# EAGLE design pannel (EAGLE 4.16)
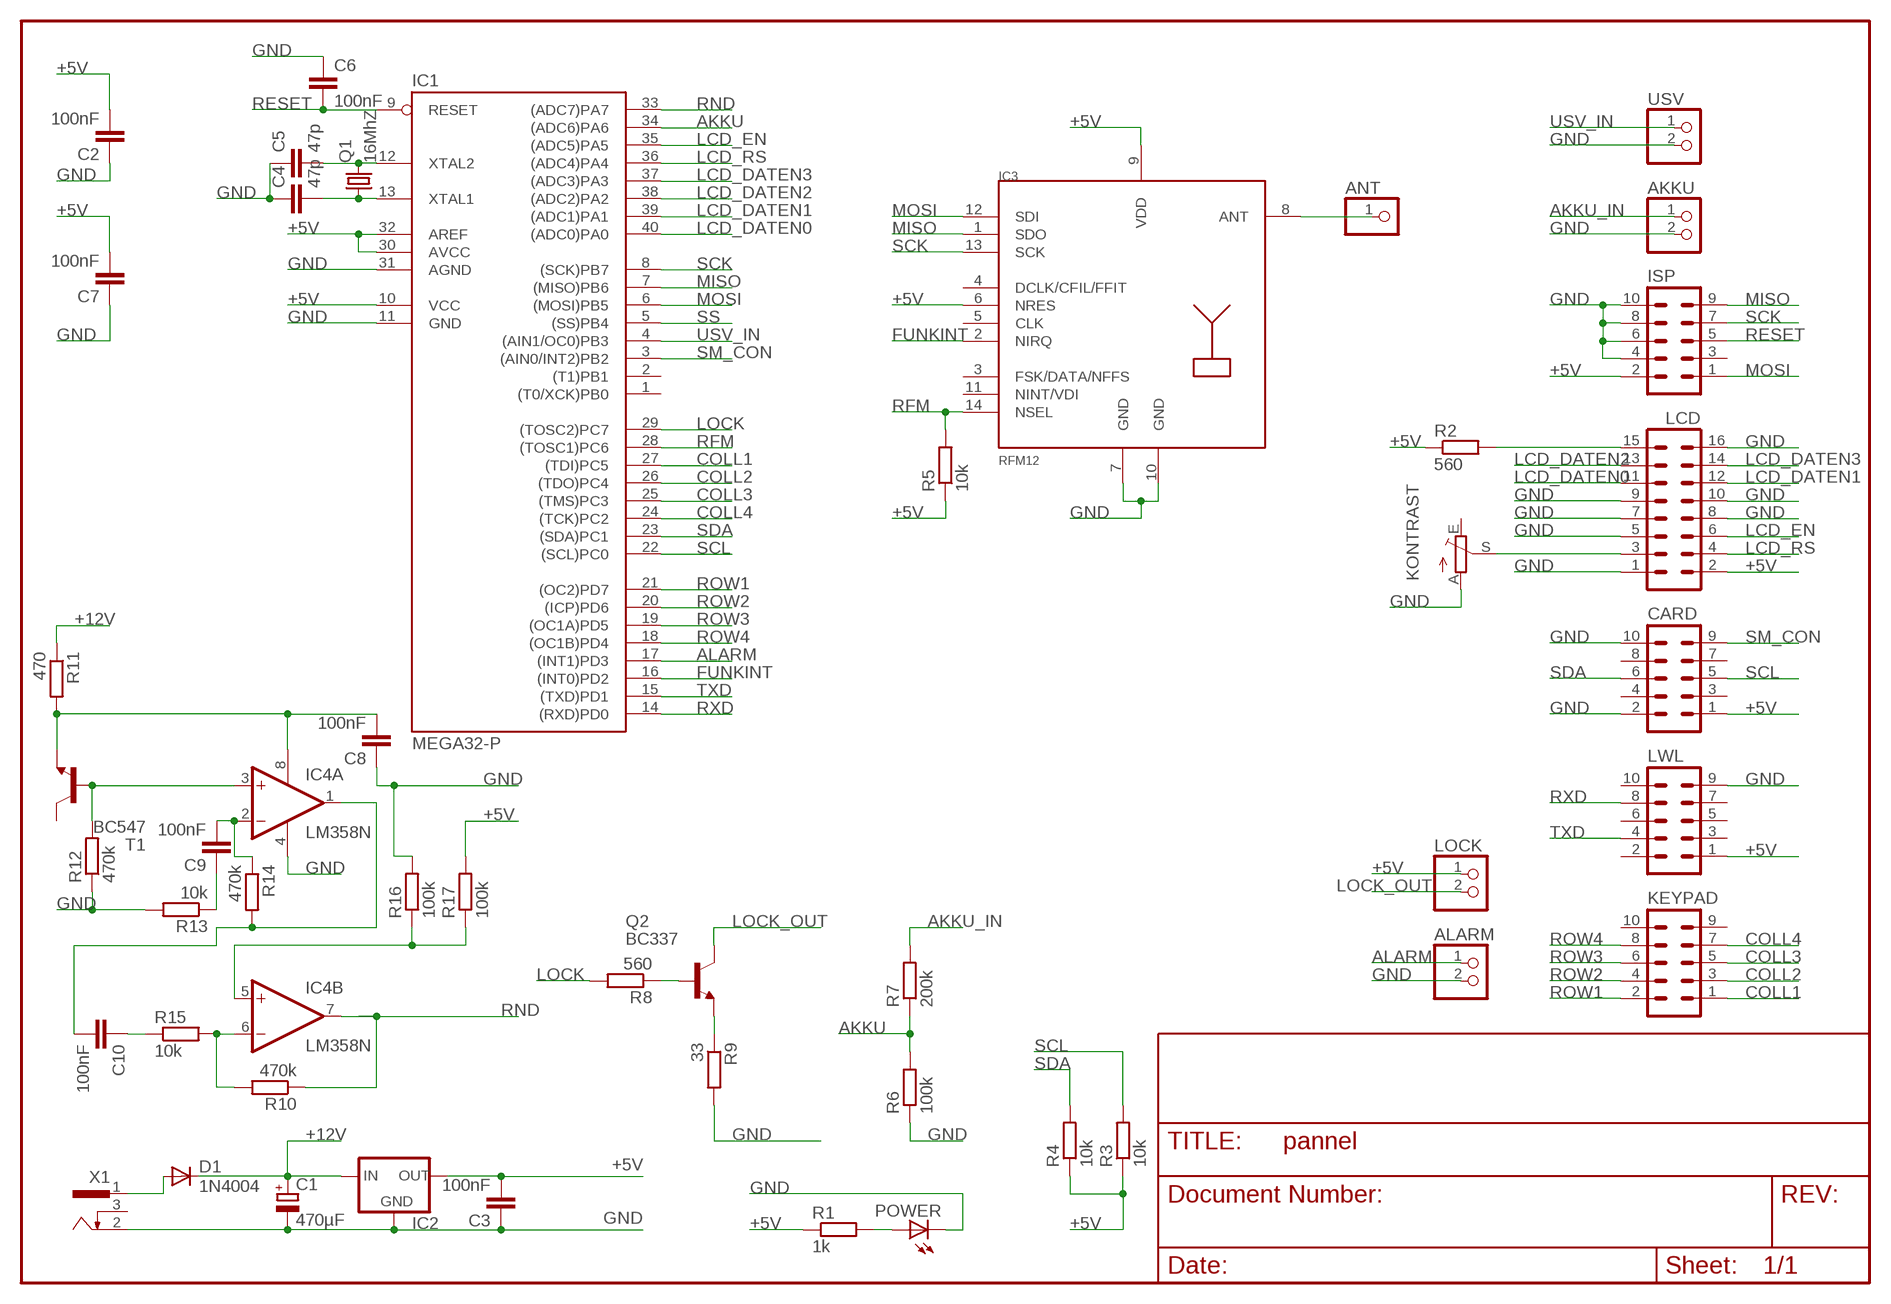
[diagram p0: schematic, sheet 1]

## Parts
AKKU  PINHD-1X2  [1X02]
ALARM  PINHD-1X2  [1X02]
ANT  PINHD-1X1  [1X01]
C1  470µF  CPOL-EUE5-8.5  [E5-8,5]
C2  100nF  C-EU025-030X050  [C025-030X050]
C3  100nF  C-EU025-030X050  [C025-030X050]
C4  47p  C-EU025-030X050  [C025-030X050]
C5  47p  C-EU025-030X050  [C025-030X050]
C6  100nF  C-EU025-030X050  [C025-030X050]
C7  100nF  C-EU025-030X050  [C025-030X050]
C8  100nF  C-EU025-030X050  [C025-030X050]
C9  100nF  C-EU025-030X050  [C025-030X050]
C10  100nF  C-EU025-030X050  [C025-030X050]
CARD  ML10  [ML10]
D1  1N4004  [DO41-10]
IC1  MEGA32-P  [DIL40]
IC2  78XXL  [78XXL]
IC3  RFM12  [RFM]
IC4  LM358N  [DIL08]
ISP  ML10  [ML10]
KEYPAD  ML10  [ML10]
KONTRAST  TRIM_EU-LI15  [LI15]
LCD  ML16  [ML16]
LOCK  PINHD-1X2  [1X02]
LWL  ML10  [ML10]
POWER  LED5MM  [LED5MM]
Q1  16MhZ  CRYSTALHC49S  [HC49/S]
Q2  BC337  [TO92]
R1  1k  R-EU_0207/12  [0207/12]
R2  560  R-EU_0207/12  [0207/12]
R3  10k  R-EU_0207/12  [0207/12]
R4  10k  R-EU_0207/12  [0207/12]
R5  10k  R-EU_0207/12  [0207/12]
R6  100k  R-EU_0207/12  [0207/12]
R7  200k  R-EU_0207/12  [0207/12]
R8  560  R-EU_0207/12  [0207/12]
R9  33  R-EU_0207/12  [0207/12]
R10  470k  R-EU_0207/12  [0207/12]
R11  470  R-EU_0207/12  [0207/12]
R12  470k  R-EU_0207/12  [0207/12]
R13  10k  R-EU_0207/12  [0207/12]
R14  470k  R-EU_0207/12  [0207/12]
R15  10k  R-EU_0207/12  [0207/12]
R16  100k  R-EU_0207/12  [0207/12]
R17  100k  R-EU_0207/12  [0207/12]
T1  BC547  [TO92]
USV  PINHD-1X2  [1X02]
X1  733980-62  [733980-62]

## Nets
+5V: C2.2 C3.2 C7.2 CARD.1 IC1.10(VCC) IC1.30(AVCC) IC1.32(AREF) IC2.OUT IC3.6(NRES) IC3.9(VDD) ISP.2 LCD.2 LOCK.1 LWL.1 R1.1 R2.1 R3.1 R4.1 R5.1 R17.2
+12V: C1.+ D1.C IC2.IN R11.1
AKKU: IC1.34((ADC6)PA6) R6.2 R7.1
AKKU_IN: AKKU.1 R7.2
ALARM: ALARM.1 IC1.17((INT1)PD3)
COLL1: IC1.27((TDI)PC5) KEYPAD.1
COLL2: IC1.26((TDO)PC4) KEYPAD.3
COLL3: IC1.25((TMS)PC3) KEYPAD.5
COLL4: IC1.24((TCK)PC2) KEYPAD.7
FUNKINT: IC1.16((INT0)PD2) IC3.2(NIRQ)
GND: AKKU.2 ALARM.2 C1.- C2.1 C3.1 C4.1 C5.1 C6.1 C7.1 C8.1 CARD.2 CARD.10 IC1.11(GND) IC1.31(AGND) IC2.GND IC3.7(GND) IC3.10(GND) IC4.4(P:V-) ISP.4 ISP.6 ISP.8 ISP.10 KONTRAST.A LCD.1 LCD.5 LCD.7 LCD.8 LCD.9 LCD.10 LCD.16 LWL.9 POWER.K(C) R6.1 R9.2 R12.1 R13.2 R16.2 USV.2 X1.2
LCD_DATEN0: IC1.40((ADC0)PA0) LCD.11
LCD_DATEN1: IC1.39((ADC1)PA1) LCD.12
LCD_DATEN2: IC1.38((ADC2)PA2) LCD.13
LCD_DATEN3: IC1.37((ADC3)PA3) LCD.14
LCD_EN: IC1.35((ADC5)PA5) LCD.6
LCD_RS: IC1.36((ADC4)PA4) LCD.4
LOCK: IC1.29((TOSC2)PC7) R8.2
LOCK_OUT: LOCK.2 Q2.3(C)
MISO: IC1.7((MISO)PB6) IC3.1(SDO) ISP.9
MOSI: IC1.6((MOSI)PB5) IC3.12(SDI) ISP.1
N$1: D1.A X1.1
N$2: C8.2 IC4.8(P:V+) R11.2 T1.1(E)
N$3: POWER.A R1.2
N$4: C4.2 IC1.13(XTAL1) Q1.1
N$5: C5.2 IC1.12(XTAL2) Q1.2
N$6: KONTRAST.S LCD.3
N$7: ANT.1 IC3.8(ANT)
N$8: Q2.2(B) R8.1
N$9: Q2.1(E) R9.1
N$10: IC4.6(B:-IN) R10.2 R15.2
N$11: IC4.3(A:+IN) R12.2 T1.2(B)
N$12: LCD.15 R2.2
N$13: C9.1 R13.1
N$14: C9.2 IC4.2(A:-IN) R14.1
N$15: IC4.5(B:+IN) R16.1 R17.1
N$16: C10.1 R15.1
N$18: C10.2 IC4.1(A:OUT) R14.2
RESET: C6.2 IC1.9(RESET) ISP.5
RFM: IC1.28((TOSC1)PC6) IC3.14(NSEL) R5.2
RND: IC1.33((ADC7)PA7) IC4.7(B:OUT) R10.1
ROW1: IC1.21((OC2)PD7) KEYPAD.2
ROW2: IC1.20((ICP)PD6) KEYPAD.4
ROW3: IC1.19((OC1A)PD5) KEYPAD.6
ROW4: IC1.18((OC1B)PD4) KEYPAD.8
RXD: IC1.14((RXD)PD0) LWL.8
SCK: IC1.8((SCK)PB7) IC3.13(SCK) ISP.7
SCL: CARD.5 IC1.22((SCL)PC0) R3.2
SDA: CARD.6 IC1.23((SDA)PC1) R4.2
SM_CON: CARD.9 IC1.3((AIN0/INT2)PB2)
SS: IC1.5((SS)PB4)
TXD: IC1.15((TXD)PD1) LWL.4
USV_IN: IC1.4((AIN1/OC0)PB3) USV.1
Unconnected: CARD.3 CARD.4 CARD.7 CARD.8 IC1.1((T0/XCK)PB0) IC1.2((T1)PB1) IC3.3(FSK/DATA/NFFS) IC3.4(DCLK/CFIL/FFIT) IC3.5(CLK) IC3.11(NINT/VDI) ISP.3 KEYPAD.9 KEYPAD.10 KONTRAST.E LWL.2 LWL.3 LWL.5 LWL.6 LWL.7 LWL.10 T1.3(C) X1.3

## Library data of the parts
AKKU ALARM LOCK USV = pinhead:PINHD-1X2: PIN HEADER
ANT = pinhead:PINHD-1X1: PIN HEADER
C1 = rcl:CPOL-EU: POLARIZED CAPACITOR, European symbol
C2-C10 = rcl:C-EU: CAPACITOR, European symbol
CARD ISP KEYPAD LWL = con-harting-ml:ML10: HARTING
D1 = diode:1N4004: DIODE general purpose rectifier, 1 A
IC1 = atmel:MEGA32-P: MICROCONTROLLER 32 Kbytes FLASH 2 Kbytes SRAM 1 Kbytes EEPROM USART 8-channel 10 bit ADC Source: www.atmel.com .. doc2503.pdf
IC2 = v-reg:78XXL: VOLTAGE REGULATOR
IC3 = Pollin_RFMxx:RFM12
IC4 = linear:LM358: OP AMP
KONTRAST = pot:TRIM_EU-: POTENTIOMETER
LCD = con-harting-ml:ML16: HARTING
POWER = led:LED: LED OSRAM: - CHIPLED LG R971, LG N971, LY N971, LG Q971, LY Q971, LO R971, LY R971 LH N974, LH R974 LS Q976, LO Q976, LY Q976 LO Q996 - Hyper CHIPLED LW Q18S LB Q993, LB Q99A, LB R99A - SideLED LS A670, LO A670, LY A670, LG A670, LP A670 LB A673, LV A673, LT A673, LW A673 LH A674 LY A675 LS A676, LA A676, LO A676, LY A676, LW A676 LS A679, LY A679, LG A679 - Hyper Micro SIDELED® LS Y876, LA Y876, LO Y876, LY Y876 LT Y87S - SmartLED LW L88C, LW L88S LB L89C, LB L89S, LG L890 LS L89K, LO L89K, LY L89K LS L896, LA L896, LO L896, LY L896 - TOPLED LS T670, LO T670, LY T670, LG T670, LP T670 LSG T670, LSP T670, LSY T670, LOP T670, LYG T670 LG T671, LOG T671, LSG T671 LB T673, LV T673, LT T673, LW T673 LH T674 LS T676, LA T676, LO T676, LY T676, LB T676, LH T676, LSB T676, LW T676 LB T67C, LV T67C, LT T67C, LS T67K, LO T67K, LY T67K, LW E67C LS E67B, LA E67B, LO E67B, LY E67B, LB E67C, LV E67C, LT E67C LW T67C LS T679, LY T679, LG T679 LS T770, LO T770, LY T770, LG T770, LP T770 LB T773, LV T773, LT T773, LW T773 LH T774 LS E675, LA E675, LY E675, LS T675 LS T776, LA T776, LO T776, LY T776, LB T776 LHGB T686 LT T68C, LB T68C - Hyper Mini TOPLED® LB M676 - Mini TOPLED Santana® LG M470 LS M47K, LO M47K, LY M47K Source: http://www.osram.convergy.de - LUMILED® LXK2-PW12-R00, LXK2-PW12-S00, LXK2-PW14-U00, LXK2-PW14-V00 LXK2-PM12-R00, LXK2-PM12-S00, LXK2-PM14-U00 LXK2-PE12-Q00, LXK2-PE12-R00, LXK2-PE12-S00, LXK2-PE14-T00, LXK2-PE14-U00 LXK2-PB12-K00, LXK2-PB12-L00, LXK2-PB12-M00, LXK2-PB14-N00, LXK2-PB14-P00, LXK2-PB14-Q00 LXK2-PR12-L00, LXK2-PR12-M00, LXK2-PR14-Q00, LXK2-PR14-R00 LXK2-PD12-Q00, LXK2-PD12-R00, LXK2-PD12-S00 LXK2-PH12-R00, LXK2-PH12-S00 LXK2-PL12-P00, LXK2-PL12-Q00, LXK2-PL12-R00 Source: www.luxeon.com
Q1 = crystal:CRYSTAL: CRYSTAL
Q2 = transistor-npn:BC337*: NPN Transistor
R1-R17 = rcl:R-EU_: RESISTOR, European symbol
T1 = transistor:BC547: NPN TRANSISTOR
X1 = con-conrad:73398?: FEMALE PRINT CONNECTOR Niedervolt-Steckverbinder Distributor Conrad

## Board
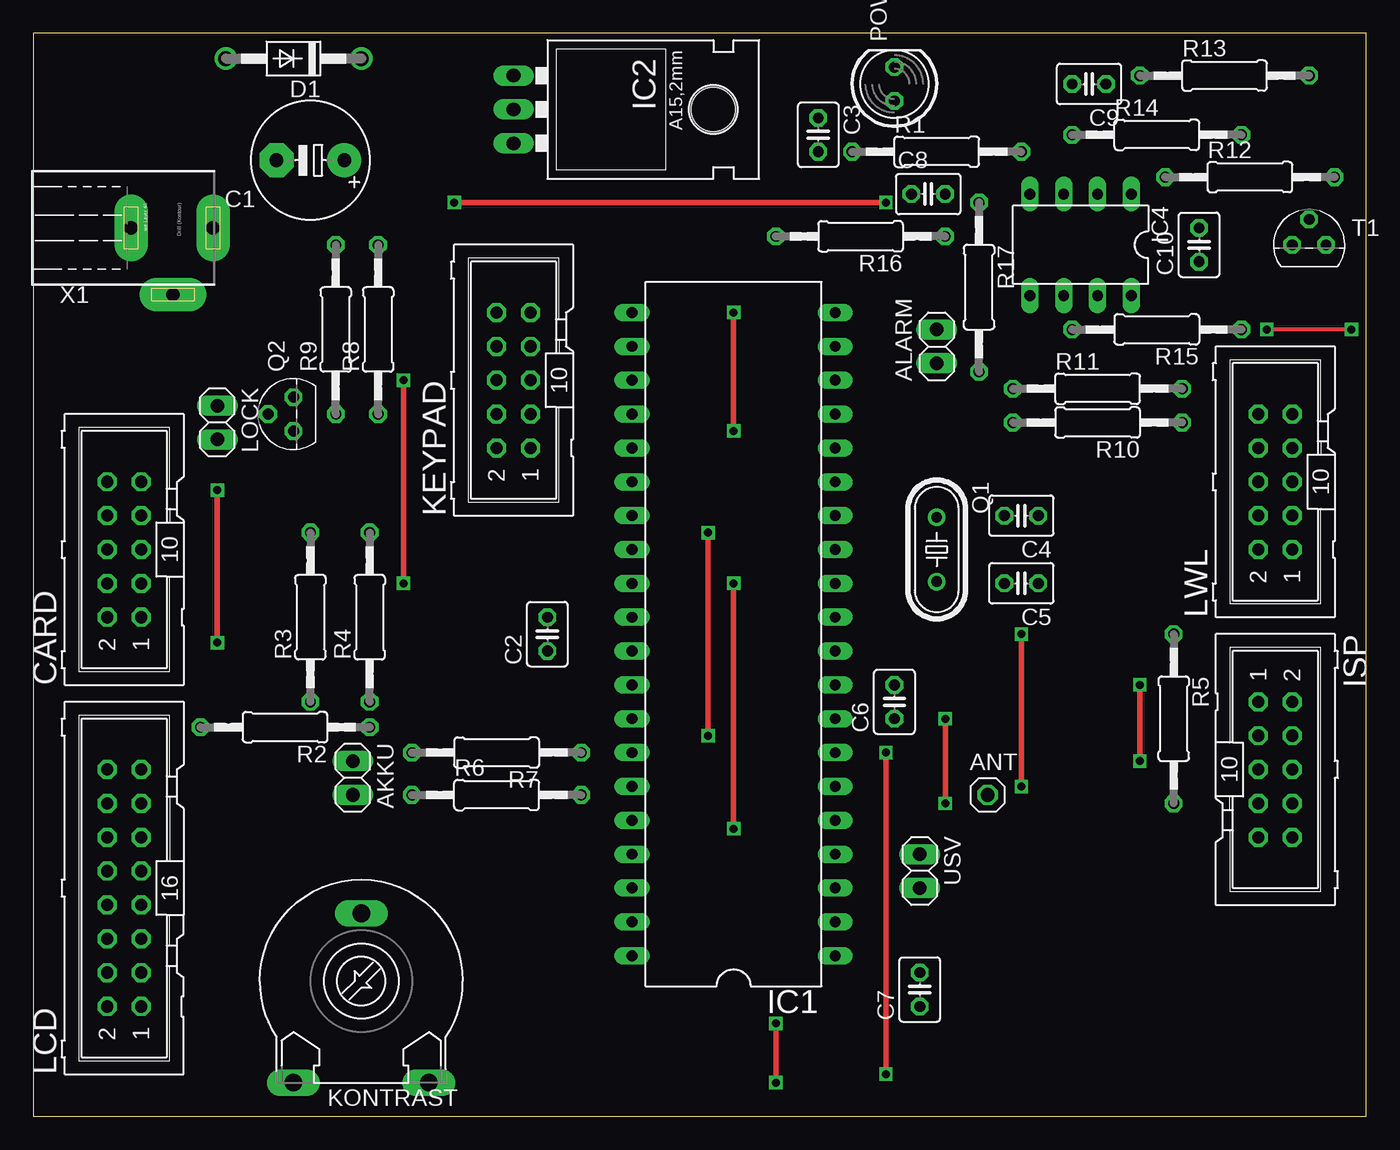
[diagram p1: board, top side]
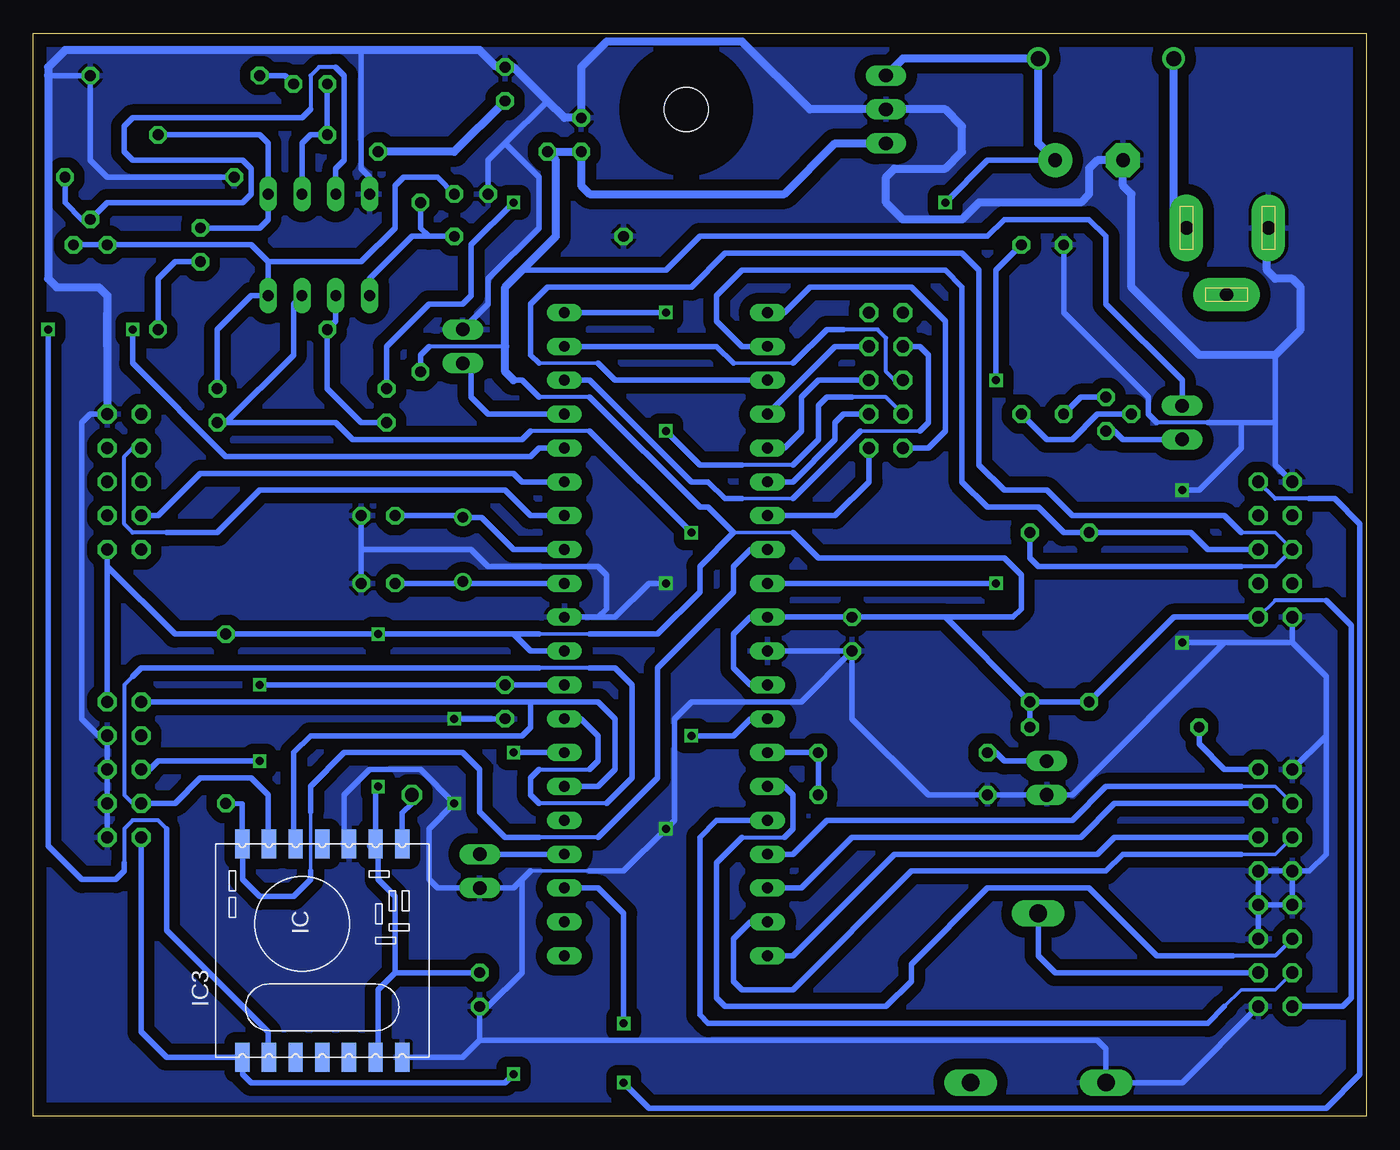
[diagram p2: board, bottom side, seen from below]

Size 100 x 81.27 mm. Coordinates in mm from the lower left corner, seen from the top.
Outline: 0,0 100,0 100,81.27 0,81.27 0,0
Copper layers (1*16): Top 0.035mm / dielectric 1.5mm / Bottom 0.035mm
Design rules "default": minimum track width 10mil, minimum drill 24mil, track to track 8mil, track to pad 8mil, pad to pad 8mil, via to via 8mil, smd to smd 8mil, copper to edge 40mil, drill to drill 8mil, minimum pad ring 10mil, minimum via ring 8mil, stop-mask expansion 4mil, vias tented up to drill 0mil, thermal gap 10mil

### Footprints (pad centres in the part's own frame; a part is rotated, then mirrored left to right if it is on the bottom)
1X02 = drill 1.016 long: 1 -1.27,0; 2 1.27,0
1X01 = drill 1.016 octagon: 1 0,0
E5-8,5 = drill 1.016 pad 2.54 round: + -2.54,0 | drill 1.016 pad 2.54 octagon: - 2.54,0
C025-030X050 = drill 0.813 octagon: 1 -1.27,0; 2 1.27,0
ML10 = drill 0.914 octagon: 1 -5.08,-1.27; 2 -5.08,1.27; 3 -2.54,-1.27; 4 -2.54,1.27; 5 0,-1.27; 6 0,1.27; 7 2.54,-1.27; 8 2.54,1.27; 9 5.08,-1.27; 10 5.08,1.27
DO41-10 = drill 1.118 round: A 5.08,0; C -5.08,0
DIL40 = drill 0.813 long: 1 -24.13,-7.62; 2 -21.59,-7.62; 3 -19.05,-7.62; 4 -16.51,-7.62; 5 -13.97,-7.62; 6 -11.43,-7.62; 7 -8.89,-7.62; 8 -6.35,-7.62; 9 -3.81,-7.62; 10 -1.27,-7.62; 11 1.27,-7.62; 12 3.81,-7.62; 13 6.35,-7.62; 14 8.89,-7.62; 15 11.43,-7.62; 16 13.97,-7.62; 17 16.51,-7.62; 18 19.05,-7.62; 19 21.59,-7.62; 20 24.13,-7.62; 21 24.13,7.62; 22 21.59,7.62; 23 19.05,7.62; 24 16.51,7.62; 25 13.97,7.62; 26 11.43,7.62; 27 8.89,7.62; 28 6.35,7.62; 29 3.81,7.62; 30 1.27,7.62; 31 -1.27,7.62; 32 -3.81,7.62; 33 -6.35,7.62; 34 -8.89,7.62; 35 -11.43,7.62; 36 -13.97,7.62; 37 -16.51,7.62; 38 -19.05,7.62; 39 -21.59,7.62; 40 -24.13,7.62
78XXL = drill 1.016 long: GND 0,-3.81; IN -2.54,-3.81; OUT 2.54,-3.81 | hole 3.302: 0,11.176
RFM = smd 2.184 x 1.067: 1 0,14; 2 0,12; 3 0,10; 4 0,8; 5 0,6; 6 0,4; 7 0,2; 8 16,2; 9 16,4; 10 16,6; 11 16,8; 12 16,10; 13 16,12; 14 16,14
DIL08 = drill 0.813 long: 1 -3.81,-3.81; 2 -1.27,-3.81; 3 1.27,-3.81; 4 3.81,-3.81; 5 3.81,3.81; 6 1.27,3.81; 7 -1.27,3.81; 8 -3.81,3.81
LI15 = drill 1.321 long: A -5.08,-7.62; E 5.08,-7.62; S 0,5.08
ML16 = drill 0.914 octagon: 1 -8.89,-1.27; 2 -8.89,1.27; 3 -6.35,-1.27; 4 -6.35,1.27; 5 -3.81,-1.27; 6 -3.81,1.27; 7 -1.27,-1.27; 8 -1.27,1.27; 9 1.27,-1.27; 10 1.27,1.27; 11 3.81,-1.27; 12 3.81,1.27; 13 6.35,-1.27; 14 6.35,1.27; 15 8.89,-1.27; 16 8.89,1.27
LED5MM = drill 0.813 octagon: A -1.27,0; K 1.27,0
HC49/S = drill 0.813 round: 1 -2.413,0; 2 2.413,0
TO92 = drill 0.813 octagon: 1 1.27,0; 2 0,1.905; 3 -1.27,0
0207/12 = drill 0.813 octagon: 1 -6.35,0; 2 6.35,0
733980-62 = drill 1 pad 2.5 long: 1 0,8.57; 2 0,2.42; 3 5,5.57

### Placement (x,y rotation side)
AKKU  23.96,25.39 270 top
ALARM  67.78,57.78 90 top
ANT  71.59,24.12 0 top
C1  20.79,71.75 180 top
C2  38.57,36.19 90 top
C3  58.89,73.66 270 top
C4  74.13,45.08 180 top
C5  74.13,40 180 top
C6  64.61,31.11 90 top
C7  66.51,9.52 90 top
C8  67.14,69.21 0 top
C9  79.21,77.47 180 top
C10  87.47,65.4 90 top
CARD  6.82,42.54 90 top
D1  19.52,79.37 180 top
IC1  52.54,36.19 90 top
IC2  39.84,75.56 270 top
IC3  70.32,4.44 90 bottom
IC4  78.58,65.4 180 top
ISP  93.18,26.03 270 top
KEYPAD  36.03,55.24 90 top
KONTRAST  24.6,10.16 0 top
LCD  6.82,17.14 90 top
LOCK  13.81,52.06 270 top
LWL  93.18,47.62 90 top
POWER  64.61,77.47 90 top
Q1  67.78,42.54 270 top
Q2  19.52,52.7 90 top
R1  67.78,72.39 0 top
R2  18.88,29.2 180 top
R3  20.79,37.46 90 top
R4  25.23,37.46 90 top
R5  85.56,29.84 270 top
R6  34.76,24.12 0 top
R7  34.76,27.3 180 top
R8  25.87,59.05 90 top
R9  22.7,59.05 90 top
R10  79.84,52.06 180 top
R11  79.84,54.6 0 top
R12  91.28,70.48 0 top
R13  89.37,78.1 0 top
R14  84.29,73.66 0 top
R15  84.29,59.05 180 top
R16  62.06,66.04 180 top
R17  70.95,62.23 270 top
T1  95.72,65.4 0 top
USV  66.51,18.41 270 top
X1  4.92,66.67 270 top

### Tracks (layer width: path | path; a pad name or v marks a point on that pad's centre or on a via)
+5V  (via drill 0.6)
  Top 0.406: v74.13,36.19 v74.13,24.76
  Bottom 0.254: IC1.10 61.43,34.92 | 6.82,38.73 CARD.1 | 58.25,36.19 62.06,36.19 | 43.02,43.81 47.46,43.81
  Bottom 0.305: 3.01,38.73 6.82,38.73 | 58.25,53.97 62.06,53.97 | 64.61,57.78 70.32,57.78
  Bottom 0.406: 94.45,41.27 ISP.2 | C2.2 IC1.30 46.19,37.46 | CARD.1 14.44,37.46 R3.1 R4.1 | 72.86,10.79 C7.2 | 72.86,10.79 74.13,9.52 74.13,4.44 IC3.6 | 94.45,41.27 89.37,36.19 R5.1 v74.13,36.19 63.97,36.19 | R4.1 R2.1 | 72.86,10.79 72.86,16.5 74.13,17.77 74.13,19.68 74.77,20.31 74.64,20.44 IC3.9 74.32,24.57 v74.13,24.76 | IC1.10 62.7,34.92 63.97,36.19 | 3.01,38.73 1.1,36.82 1.1,8.88 1.74,8.25 LCD.2 | IC1.32 46.19,32.38 47.46,33.65 47.46,36.19 46.19,37.46 | 58.25,36.19 53.17,36.19 50,39.37 50,41.27 47.46,43.81 49.37,45.71 50,45.71 58.25,53.97 | 63.97,55.24 63.34,55.24 62.06,53.97 | LOCK.1 13.81,55.24 19.52,60.95 19.52,66.04 20.79,67.31 27.14,67.31 28.41,66.04 50,66.04 52.54,63.49 63.34,63.49 | 43.02,43.81 41.11,41.91 27.14,41.91 25.87,40.63 25.87,38.09 26.5,37.46 C2.2 | C2.2 46.19,37.46 | C2.2 31.58,37.46 R4.1 | 94.45,41.27 LWL.1 | R17.2 70.95,57.14 70.32,57.78 | 62.06,36.19 63.97,36.19
  Bottom 0.61: IC2.OUT 39.84,73.02 43.65,69.21 58.25,69.21 58.89,69.84 C3.2 R1.1 60.8,71.75 60.8,66.04 63.34,63.49 64.61,62.23 64.61,57.78 64.61,55.88 63.97,55.24
+12V  (via drill 0.6)
  Top 0.406: v31.58,68.58 v63.97,68.58
  Bottom 0.406: R11.1 73.5,57.78 70.32,60.95 67.78,60.95 67.14,61.59 67.14,65.4 v63.97,68.58 | C1.+ 28.41,71.75 v31.58,68.58
  Bottom 0.61: IC2.IN 34.76,79.37 D1.C 24.6,73.02 C1.+
AKKU
  Bottom 0.406: IC1.34 R7.1 R6.2
AKKU_IN
  Bottom 0.406: R7.2 27.77,27.3 27.14,26.66 AKKU.1
ALARM
  Bottom 0.406: IC1.17 65.88,52.7 67.14,53.97 67.14,55.88 ALARM.1
COLL1
  Bottom 0.406: IC1.27 39.84,45.08 37.3,47.62 KEYPAD.1
COLL2
  Bottom 0.406: IC1.26 43.02,47.62 39.84,50.8 39.84,52.06 39.2,52.7 KEYPAD.3
COLL3
  Bottom 0.406: IC1.25 43.65,50.16 42.38,51.43 42.38,53.97 41.11,55.24 KEYPAD.5
COLL4
  Bottom 0.406: IC1.24 39.84,57.78 KEYPAD.7
FUNKINT  (via drill 0.6)
  Top 0.305: v98.89,59.05 v92.55,59.05
  Bottom 0.305: 82.32,3.8 IC3.2 | 93.18,19.04 93.18,21.58 92.55,22.22 90.64,22.22 90,21.58
  Bottom 0.406: v98.89,59.05 98.89,20.31 96.36,17.77 93.81,17.77 93.18,18.41 93.18,19.04 | 82.39,3.8 82.32,3.8 | 90,21.58 90,13.96 82.39,6.35 82.39,4.44 IC3.2 | v92.55,59.05 92.55,56.51 85.56,49.52 62.7,49.52 62.06,50.16 IC1.16
GND  (via drill 0.6)
  Top 0.406: v52.54,21.58 v52.54,40 | v68.41,23.49 v68.41,29.84 | v13.81,35.55 v13.81,46.98
  Bottom 0.254: 76.67,20.95 IC3.10 76.67,19.68 | 62.7,18.41 58.25,18.41
  Bottom 0.305: 11.9,52.06 15.71,52.06
  Bottom 0.406: ISP.10 ISP.8 ISP.6 ISP.4 95.08,28.57 96.36,29.84 96.36,52.06 95.72,52.7 LWL.9 | 75.4,42.54 C4.1 | 75.4,42.54 C5.1 | C2.1 IC1.31 | LCD.7 LCD.5 | LCD.7 LCD.8 LCD.10 | LCD.7 LCD.9 LCD.10 | C2.1 38.57,29.84 32.85,24.12 R6.1 AKKU.2 22.06,24.12 10.63,35.55 5.55,35.55 | 3.01,28.57 3.01,33.02 5.55,35.55 | 3.01,28.57 LCD.16 | 58.25,18.41 55.71,18.41 v52.54,21.58 51.91,22.22 51.91,29.84 50.63,31.11 42.38,31.11 C2.1 | LCD.1 13.81,2.54 KONTRAST.A 19.52,5.07 20.15,5.71 66.51,5.71 | 59.52,37.46 IC1.11 57.62,37.46 | 72.86,42.54 75.4,42.54 | 72.86,42.54 72.22,42.54 | 72.86,42.54 67.14,42.54 65.88,41.27 57.62,41.27 56.98,40.63 56.98,38.09 57.62,37.46 | 76.67,20.95 76.67,24.12 74.77,26.03 70.95,26.03 v68.41,23.49 70.32,21.58 70.32,17.77 69.69,17.14 USV.2 63.97,17.14 63.34,17.77 | 57.62,37.46 56.35,37.46 53.81,40 v52.54,40 | LCD.10 4.28,18.41 3.01,19.68 3.01,28.57 | v68.41,29.84 C6.1 | 63.34,17.77 63.34,10.79 65.88,8.25 C7.1 66.51,5.71 | 63.34,17.77 62.7,18.41 | IC3.7 67.78,4.44 66.51,5.71 | 6.82,52.06 6.82,57.14 | 6.82,52.06 6.82,48.89 CARD.10 | R9.2 22.7,60.32 16.34,53.97 16.34,52.7 15.71,52.06 | 11.27,52.06 11.9,52.06 9.36,52.06 | 9.36,52.06 6.82,52.06 | C8.1 65.88,71.75 64.61,73.02 | 61.43,76.2 64.61,73.02 | 98.89,78.1 R13.2 95.72,71.75 94.45,70.48 R12.1 | IC4.4 74.77,70.48 75.4,71.12 75.4,80.01 | ALARM.2 65.88,60.95 65.88,62.86 62.06,66.67 62.06,70.48 64.61,73.02 | 5.55,35.55 CARD.2 | 5.55,35.55 v13.81,35.55 | v13.81,46.98 12.54,46.98 9.36,50.16 9.36,52.06
  Bottom 0.61: 7.33,64.64 X1.2 7.46,66.67 7.46,63.49 6.82,62.86 5.55,62.86 4.92,62.23 4.92,59.05 6.82,57.14 12.54,57.14 17.61,62.23 17.61,69.21 18.25,69.84 C1.- 20.15,71.75 20.79,71.12 20.79,69.21 21.42,68.58 29.04,68.58 30.31,67.31 34.76,67.31 36.03,68.58 36.03,70.48 35.39,71.12 31.58,71.12 30.31,72.39 30.31,74.29 31.58,75.56 IC2.GND 41.74,75.56 46.82,80.64 56.98,80.64 58.89,78.73 C3.1 60.16,74.93 61.43,76.2 63.97,78.73 POWER.K 65.24,78.73 66.51,80.01 69.05,80.01 75.4,80.01 97.62,80.01 98.89,78.73 98.89,78.1 98.89,62.86 98.26,62.23 95.08,62.23 94.45,61.59 94.45,57.78 | 94.45,57.78 LWL.9 | 94.45,57.78 94.45,60.32
  pour Bottom (isolate 0.813): 100.8,0.63 0.47,-0.01 -0.8,81.28 -0.17,81.91 100.16,81.91 100.8,81.28
LCD_DATEN0
  Bottom 0.254: IC1.40 43.65,12.06
  Bottom 0.406: IC1.40 43.02,12.06 35.39,19.68 20.15,19.68 18.88,20.95 LCD.11
LCD_DATEN1
  Bottom 0.254: 9.36,19.68 6.82,19.68 LCD.12
  Bottom 0.406: IC1.39 46.19,14.6 47.46,13.33 47.46,10.16 46.82,9.52 43.02,9.52 34.12,18.41 19.52,18.41 18.25,19.68 9.36,19.68
LCD_DATEN2
  Bottom 0.406: IC1.38 42.38,17.14 38.57,20.95 21.42,20.95 18.88,23.49 LCD.13
LCD_DATEN3
  Bottom 0.254: 9.36,24.76 6.82,24.76 LCD.14
  Bottom 0.406: 9.36,24.76 19.52,24.76 22.06,22.22 40.48,22.22 43.02,19.68 IC1.37
LCD_EN
  Bottom 0.305: LCD.6 6.82,12.06 10,12.06 | 46.82,20.95 43.65,20.95
  Bottom 0.406: IC1.35 43.65,24.76 43.02,24.12 43.02,21.58 43.65,20.95 | 46.82,20.95 48.73,19.04 48.73,8.88 48.09,8.25 36.03,8.25 34.12,10.16 34.12,11.43 28.41,17.14 20.79,17.14 15.71,12.06 10,12.06
LCD_RS
  Bottom 0.254: 10.63,8.25 9.36,9.52 6.82,9.52 LCD.4
  Bottom 0.406: IC1.36 48.73,22.22 50,20.95 50,7.62 49.37,6.98 11.9,6.98 10.63,8.25
LOCK  (via drill 0.6)
  Top 0.406: v27.77,40 v27.77,55.24
  Bottom 0.406: v27.77,40 IC1.29 | v27.77,55.24 27.77,63.49 R8.2
LOCK_OUT
  Bottom 0.406: Q2.3 18.88,51.43 18.25,50.8 LOCK.2
MISO  (via drill 0.6)
  Top 0.406: v63.97,3.17 v63.97,27.3
  Bottom 0.406: ISP.9 91.91,6.35 90,4.44 IC3.1 84.29,4.44 84.29,3.17 83.66,2.54 64.61,2.54 v63.97,3.17 | v63.97,27.3 IC1.7
MOSI
  Bottom 0.254: 80.48,20.95 IC3.12
  Bottom 0.406: IC1.6 57.62,24.76 56.35,26.03 56.35,29.84 57.62,31.11 62.7,31.11 | 62.7,31.11 ISP.1 | 62.7,31.11 62.7,29.2 63.34,28.57 79.21,28.57 80.48,27.3 80.48,20.95
N$1
  Bottom 0.61: X1.1 13.81,66.67 14.44,67.31 D1.A
N$2
  Bottom 0.406: T1.1 83.66,65.4 82.39,64.13 | 82.39,64.13 IC4.8 83.66,61.59 86.19,59.05 R11.2 | C8.2 69.69,70.48 72.22,70.48 72.86,69.84 72.86,66.67 75.4,64.13 82.39,64.13
N$3
  Bottom 0.61: R1.2 68.41,72.39 POWER.A
N$4
  Bottom 0.406: IC1.13 63.97,42.54 66.38,44.95 Q1.1 67.78,45.08 C4.2
N$5
  Bottom 0.406: IC1.12 67.78,40 | 67.78,40 Q1.2 | 67.78,40 C5.2
N$6
  Bottom 0.406: LCD.3 23.33,10.79 24.6,12.06 KONTRAST.S
N$7
  Bottom 0.406: IC3.8 72.32,22.76 71.59,23.49 ANT.1
N$8
  Bottom 0.406: R8.1 23.96,50.8 22.06,50.8 20.15,52.7 Q2.2
N$9
  Bottom 0.406: Q2.1 21.42,53.97 R9.1
N$10
  Bottom 0.406: IC4.6 77.3,59.68 R15.2 77.94,54.6 75.4,52.06 R10.2
N$11
  Bottom 0.305: 77.3,78.73 78.58,78.73 79.21,78.1 79.21,75.56
  Bottom 0.406: R12.2 97.62,68.58 96.36,67.31 T1.2 94.45,68.58 84.29,68.58 83.66,69.21 83.66,71.12 84.29,71.75 92.55,71.75 93.18,72.39 93.18,74.29 92.55,74.93 79.84,74.93 79.21,75.56 | IC4.3 77.3,71.12 76.67,71.75 76.67,78.1 77.3,78.73
N$12
  Bottom 0.406: R2.2 12.54,27.93 10.63,26.03 LCD.15
N$13
  Bottom 0.406: R13.1 81.11,78.1 C9.1
N$14
  Bottom 0.406: C9.2 R14.1 79.21,73.66 79.84,73.02 IC4.2
N$15
  Bottom 0.406: 74.77,62.86 74.13,63.49 | 74.77,62.86 IC4.5 | R17.1 70.95,66.67 70.32,66.04 R16.1 71.59,66.04 74.77,62.86
N$16
  Bottom 0.406: C10.1 89.37,64.13 90.64,62.86 R15.1
N$18
  Bottom 0.406: R14.2 83.02,73.66 82.39,73.02 IC4.1 82.39,67.31 83.02,66.67 C10.2
RESET  (via drill 0.6)
  Top 0.406: v83.02,32.38 v83.02,26.66
  Bottom 0.406: IC1.9 C6.2 v83.02,32.38 | v83.02,26.66 90.64,26.66 91.28,26.03 ISP.5
RFM
  Bottom 0.254: 84.29,19.68 IC3.14 | 79.21,22.85 79.21,18.41
  Bottom 0.305: 57.62,20.95 62.06,20.95
  Bottom 0.406: IC3.14 84.32,23.46 R5.2 | IC1.28 46.19,42.54 47.46,41.27 47.46,39.37 53.17,33.65 53.17,25.39 57.62,20.95 | 84.29,19.68 84.29,17.77 83.02,16.5 80.48,16.5 79.21,17.77 79.21,18.41 | 79.21,22.85 79.21,24.76 76.67,27.3 67.78,27.3 66.51,26.03 66.51,22.85 64.61,20.95 62.06,20.95
RND  (via drill 0.6)
  Top 0.406: v50.63,28.57 v50.63,43.81
  Bottom 0.305: 58.25,51.43 62.7,51.43
  Bottom 0.406: 85.56,52.06 R10.1 | IC4.7 80.48,60.95 80.48,57.14 85.56,52.06 | 85.56,52.06 77.3,52.06 76.03,50.8 63.34,50.8 62.7,51.43 | v50.63,43.81 58.25,51.43 | v50.63,28.57 47.46,28.57 46.19,29.84 IC1.33
ROW1
  Bottom 0.406: IC1.21 43.65,60.32 41.74,62.23 34.12,62.23 31.58,59.68 31.58,51.43 32.85,50.16 KEYPAD.2
ROW2  (via drill 0.6)
  Top 0.406: v52.54,51.43 v52.54,60.32
  Bottom 0.305: KEYPAD.4 36.03,53.97 38.57,53.97 | 43.02,48.89 46.82,48.89
  Bottom 0.406: v52.54,51.43 50,48.89 46.82,48.89 | v52.54,60.32 IC1.20 | 38.57,53.97 40.48,53.97 41.11,53.34 41.11,50.8 43.02,48.89
ROW3
  Bottom 0.254: 43.02,56.51 47.46,56.51
  Bottom 0.305: KEYPAD.6 35.39,55.24 36.03,55.88 36.03,58.41 36.66,59.05 39.2,59.05
  Bottom 0.406: IC1.19 48.73,57.78 47.46,56.51 | 39.2,59.05 40.48,59.05 43.02,56.51
ROW4
  Bottom 0.254: 43.02,46.35 46.82,46.35 | 33.49,51.43 37.94,51.43
  Bottom 0.406: KEYPAD.8 33.49,57.78 32.85,57.14 32.85,52.06 33.49,51.43 | IC1.18 58.25,55.24 50.63,47.62 49.37,47.62 48.09,46.35 46.82,46.35 | 37.94,51.43 43.02,46.35
RXD
  Bottom 0.305: LWL.8 92.55,50.16 93.18,49.52 93.18,44.45 92.55,43.81 90,43.81
  Bottom 0.406: 61.43,45.08 IC1.14 62.7,45.08 64.61,46.98 83.02,46.98 86.19,43.81 90,43.81
SCK
  Bottom 0.305: 56.98,23.49 62.06,23.49 | 62.06,26.03 58.25,26.03 | ISP.7 92.55,23.49 93.18,24.12 93.18,32.38 92.55,33.02 | 58.25,33.65 62.06,33.65
  Bottom 0.406: 62.06,26.03 62.7,25.39 62.7,24.12 62.06,23.49 | IC1.8 58.89,29.84 57.62,28.57 57.62,26.66 58.25,26.03 | ISP.7 89.37,23.49 87.47,25.39 83.66,25.39 82.39,24.12 82.39,20.31 82.32,20.38 IC3.13 | 56.98,23.49 55.08,25.39 55.08,32.38 56.35,33.65 58.25,33.65 | 62.06,33.65 91.91,33.65 92.55,33.02
SCL
  Bottom 0.406: CARD.5 11.9,42.54 13.17,43.81 R3.2 22.7,43.81 24.6,45.71 28.41,45.71 30.31,47.62 30.31,62.23 31.58,63.49 46.82,63.49 48.73,61.59 48.73,59.68 46.82,57.78 IC1.22
SDA
  Bottom 0.254: 62.06,56.51 57.62,56.51 | 9.36,43.81 6.82,43.81 CARD.6
  Bottom 0.305: 9.36,41.27 6.82,41.27 CARD.6
  Bottom 0.406: R4.2 25.23,41.91 24.6,41.27 9.36,41.27 | IC1.23 56.35,55.24 57.62,56.51 | 62.06,56.51 62.7,57.14 62.7,60.95 61.43,62.23 50.63,62.23 48.09,64.77 30.31,64.77 29.04,63.49 29.04,48.89 27.14,46.98 23.96,46.98 22.06,45.08 10.63,45.08 9.36,43.81
SM_CON  (via drill 0.6)
  Top 0.406: v55.71,2.54 v55.71,6.98
  Bottom 0.305: CARD.9 6.82,46.35 4.28,46.35
  Bottom 0.406: 4.28,46.35 2.38,46.35 0.47,44.45 0.47,3.17 3.01,0.63 53.81,0.63 v55.71,2.54 | v55.71,6.98 55.71,15.24 57.62,17.14 IC1.3
TXD
  Bottom 0.406: 61.43,47.62 IC1.15 63.34,47.62 63.97,48.25 87.47,48.25 90.64,45.08 LWL.4
USV_IN
  Bottom 0.406: IC1.4 USV.1